# Altium schematic sheet Sheet_1.SchDoc
size A; SheetNumber: 1; SheetTotal: 1
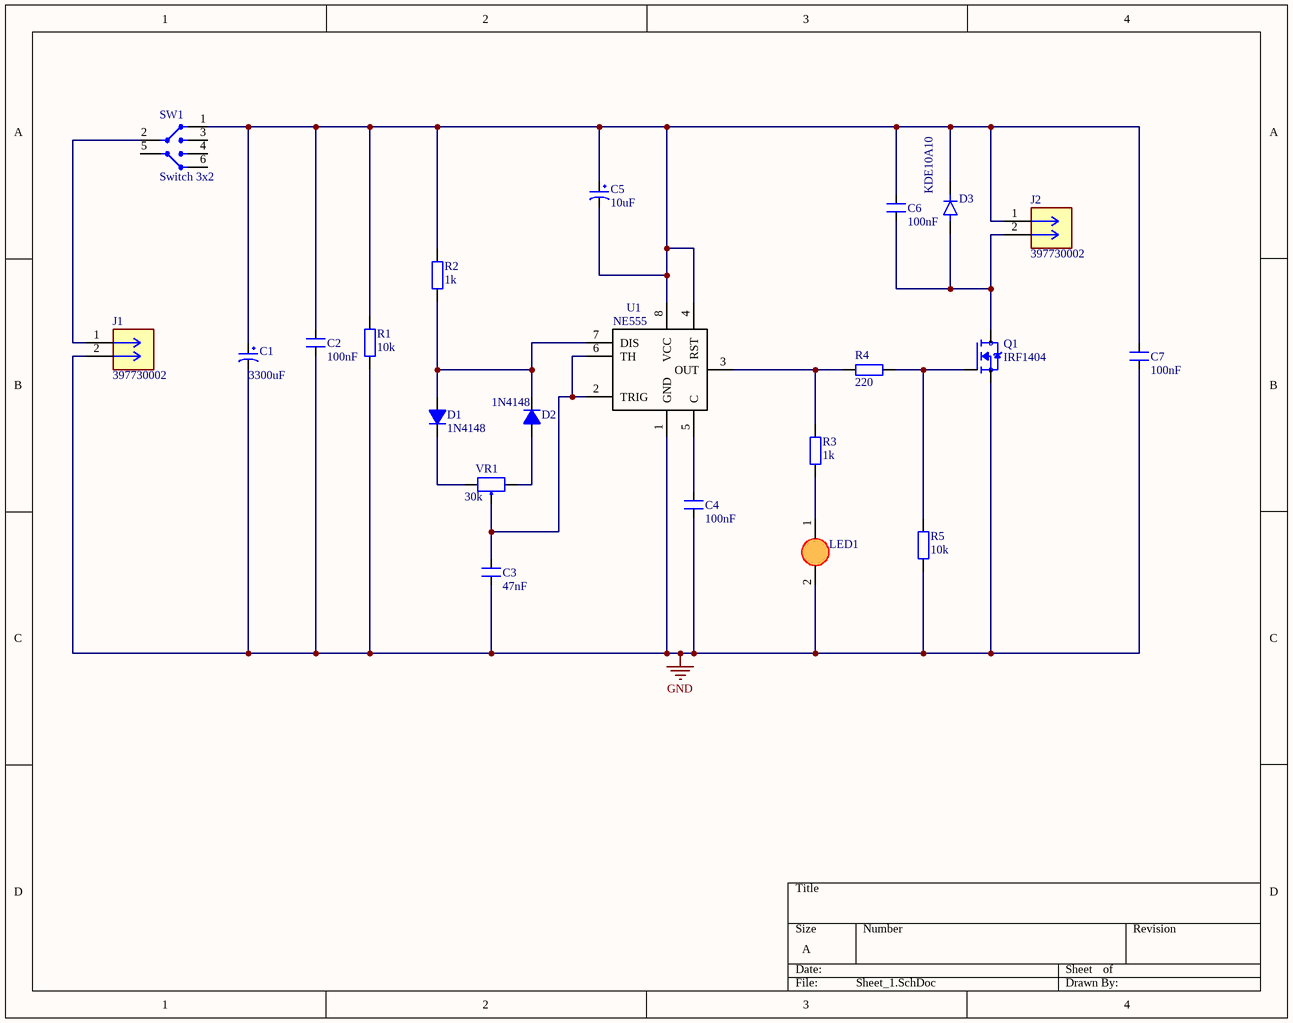
[diagram p0: Sheet_1.SchDoc]

## Parts
C1  3300uF  [CP1.5/3.4]
C2  100nF  [CN1.5]
C3  47nF  [CN1.5]
C4  100nF  [CN1.5]
C5  10uF  [CP1/2]
C6  100nF  [CN1.5]
C7  100nF  [CN1.5]
D1  1N4148  [D0.5A]
D2  1N4148  [D0.5A]
D3  KDE10A10  [DIOAD1990W125L900D530]
J1  397730002  [CONN_39773-0002_MOL]
J2  397730002  [CONN_39773-0002_MOL]
LED1  LED5  [LED-5 GRe]  (value not drawn)
Q1  IRF1404  [TO254P1016X419X2286-3]
R1  10k  [R1/4W]
R2  1k  [R1/4W]
R3  1k  [R1/4W]
R4  220  [R1/4W]
R5  10k  [R1/4W]
SW1  Switch 3x2  [SW3-DIP]
U1  NE555  [DIP8]
VR1  30k  [VOL_1]

## Nets
GND: C1.2 C2.2 C3.1 C4.1 C7.2 J1.2 LED1.2(K) Q1.3(S) R1.1 R5.1 U1.1(GND)
NetC1_1: C1.1 C2.1 C5.1 C5.2 C6.2 C7.1 D3.C(K) J2.1 R1.2 R2.2 SW1.1 U1.4(RST) U1.8(VCC)
NetC3_2: C3.2 U1.2(TRIG) U1.6(TH) VR1.2
NetC4_2: C4.2 U1.5(C)
NetC6_1: C6.1 D3.A J2.2 Q1.2(D)
NetD1_1: D1.1(A) D2.2(K) R2.1 U1.7(DIS)
NetD1_2: D1.2(K) VR1.3
NetD2_1: D2.1(A) VR1.1
NetJ1_1: J1.1 SW1.2
NetLED1_1: LED1.1(A) R3.1
NetQ1_1: Q1.1(G) R4.1 R5.2
NetR3_2: R3.2 R4.2 U1.3(OUT)

Not connected (* = marked no-connect by the designer): SW1 3(I/O2) 4 5(6) 6

## Library data of the parts
C1 = CP3: Cap 100uF/35V - 470uF/16V; Value: 100uF/35V/50V; Description 1: 1000uF/6,3V - 470uF/16V - 330uF - 25V; Description 2: 220uF/35V - 100uF/50V - 63V - 4,7uF/200V; Description 3: 22uF => 33uF100V - 3,3uF => 4,7uF/250V; Description 4: 2,2uF =>3,3uF/350 - 2,2uF/400V - 1uF/450V
C2-C4 C6 C7 = CN: Value: 33pF
C5 = CP1: Cap P  0,1uF < 22uF , 16 - 50V; Value: 10uF/50V; Description 1: 10 => 220uF/6,3V/10V - 10uF => 100uF/16V; Description 2: 0,1uF => 33uF/50V - 10uF => 22uF/63V; Description 3: 0,47uF => 10uF/100V
D1 D2 = D0.5A: Value: 1N4148
D3 = SR320: 3A, 200V, Schottky Rectifier; MF: Taiwan Semiconductor; SnapEDA_Link: https://www.snapeda.com/parts/SR320/Taiwan+Semiconductor/view-part/?ref=snap; Package: DO-201AD Taiwan Semiconductor; Value: *; MP: SR320; Check_prices: https://www.snapeda.com/parts/SR320/Taiwan+Semiconductor/view-part/?ref=eda
J1 J2 = 397730002: 2 Position Wire to Board Terminal Block Horizontal with Board 0.100 (2.54mm) Through Hole; MF: Molex; SnapEDA_Link: https://www.snapeda.com/parts/397730002/Molex/view-part/?ref=snap; Package: None; Value: *; MP: 397730002; Check_prices: https://www.snapeda.com/parts/397730002/Molex/view-part/?ref=eda
LED1 = LED 5mm
Q1 = IRFZ44N: N-Channel 55 V 49A (Tc) 94W (Tc) Through Hole TO-220AB; MF: Infineon Technologies; Check_prices: https://www.snapeda.com/parts/IRFZ44N/Infineon+Technologies/view-part/?ref=eda; Package: TO-220-3 Infineon; MP: IRFZ44N; Value: *; Availability: In Stock; Purchase-URL: https://pricing.snapeda.com/search/part/IRFZ44N/?ref=eda; SnapEDA_Link: https://www.snapeda.com/parts/IRFZ44N/Infineon+Technologies/view-part/?ref=snap; Price: None
R1-R5 = R1/4W: Resistor 1/4W; Value: R1/4W - 1K
SW1 = SW3x2: Value: Switch 4x2
U1 = NE555: TIMER IC; Manufacturer Part Number: NE555DT; Manufacturer: STMicroelectronics; Frequency: 500kHz; Voltage - Supply: 4.5 V ~ 16 V; Current: 200mA; Supplier 1: Digi-Key; Supplier Part Number 1: 497-1962-2-ND; Supplier: Digi-Key; Category: Integrated Circuits (ICs); Supplier Part Number: 497-1962-2-ND; Package / Case: 8-SOIC (3.9mm Width); Packaging: Tape & Reel (TR); RoHS: RoHS Compliant; Operating Temperature: 0°C ~ 70°C; Count: -; Type: 555 Type, Timer/Oscillator (Single)
VR1 = Var Resitor: Var Resistor; Value: VR 10K